# Altium schematic sheet RK3566.SchDoc
size A1; SheetNumber: 2; SheetTotal: 6
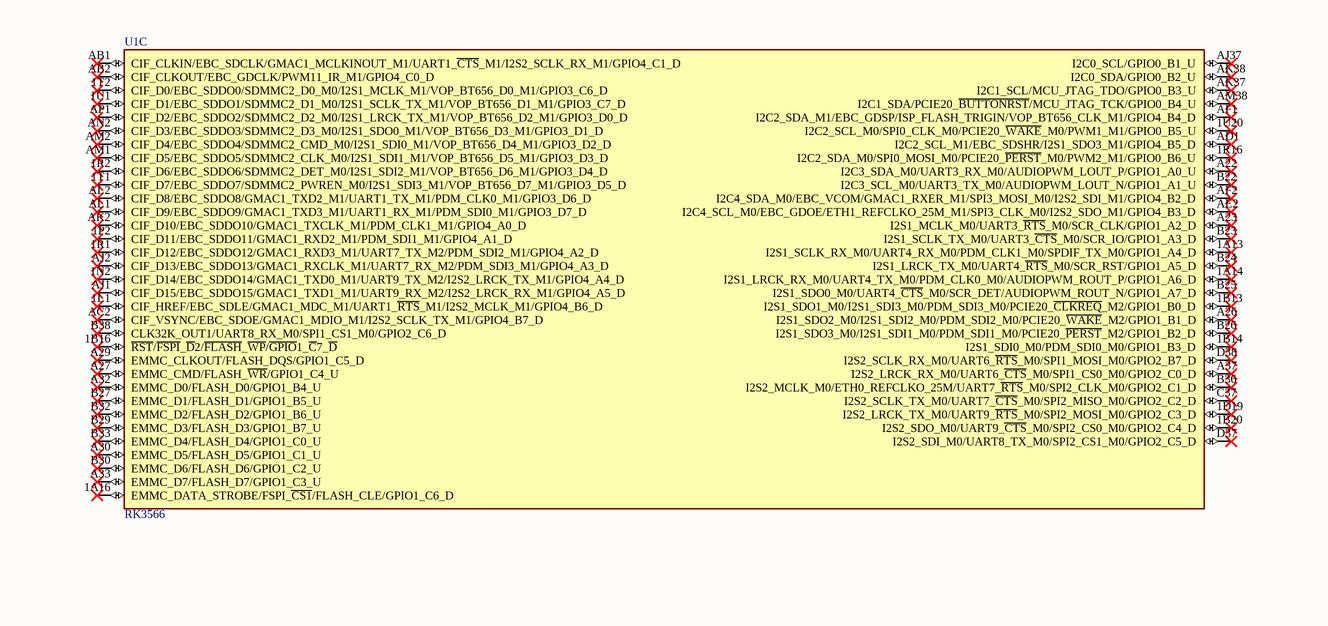
[diagram p0: RK3566.SchDoc, top left]
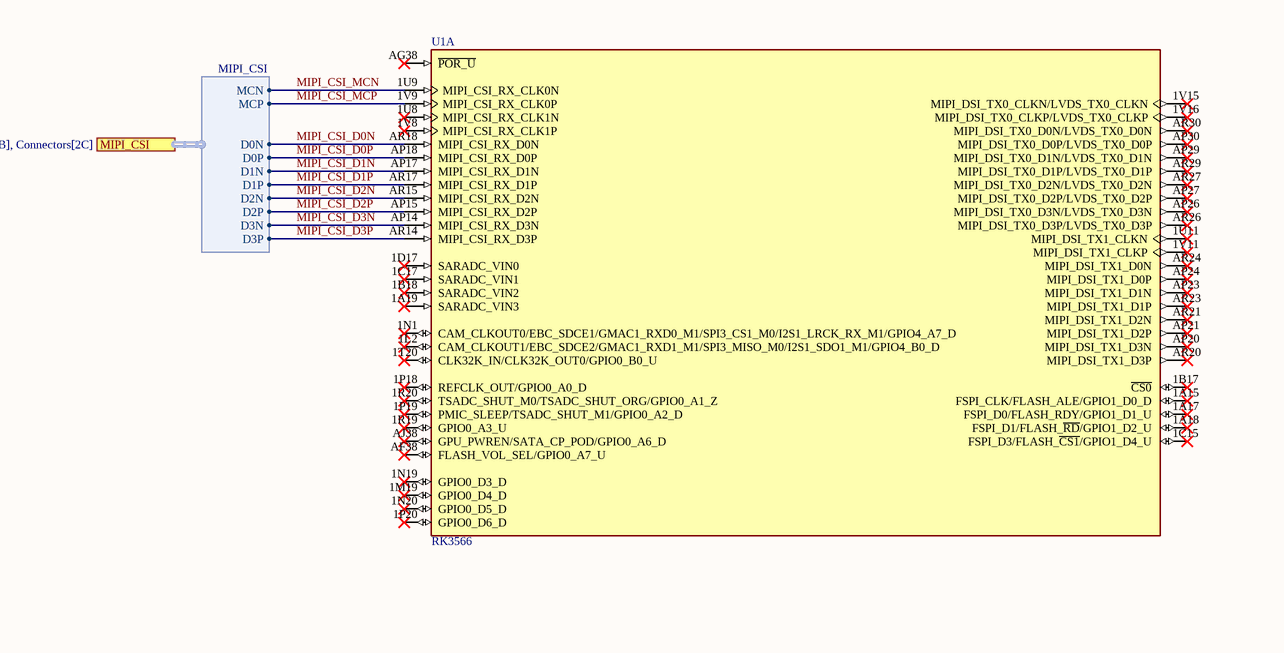
[diagram p1: RK3566.SchDoc, top right]
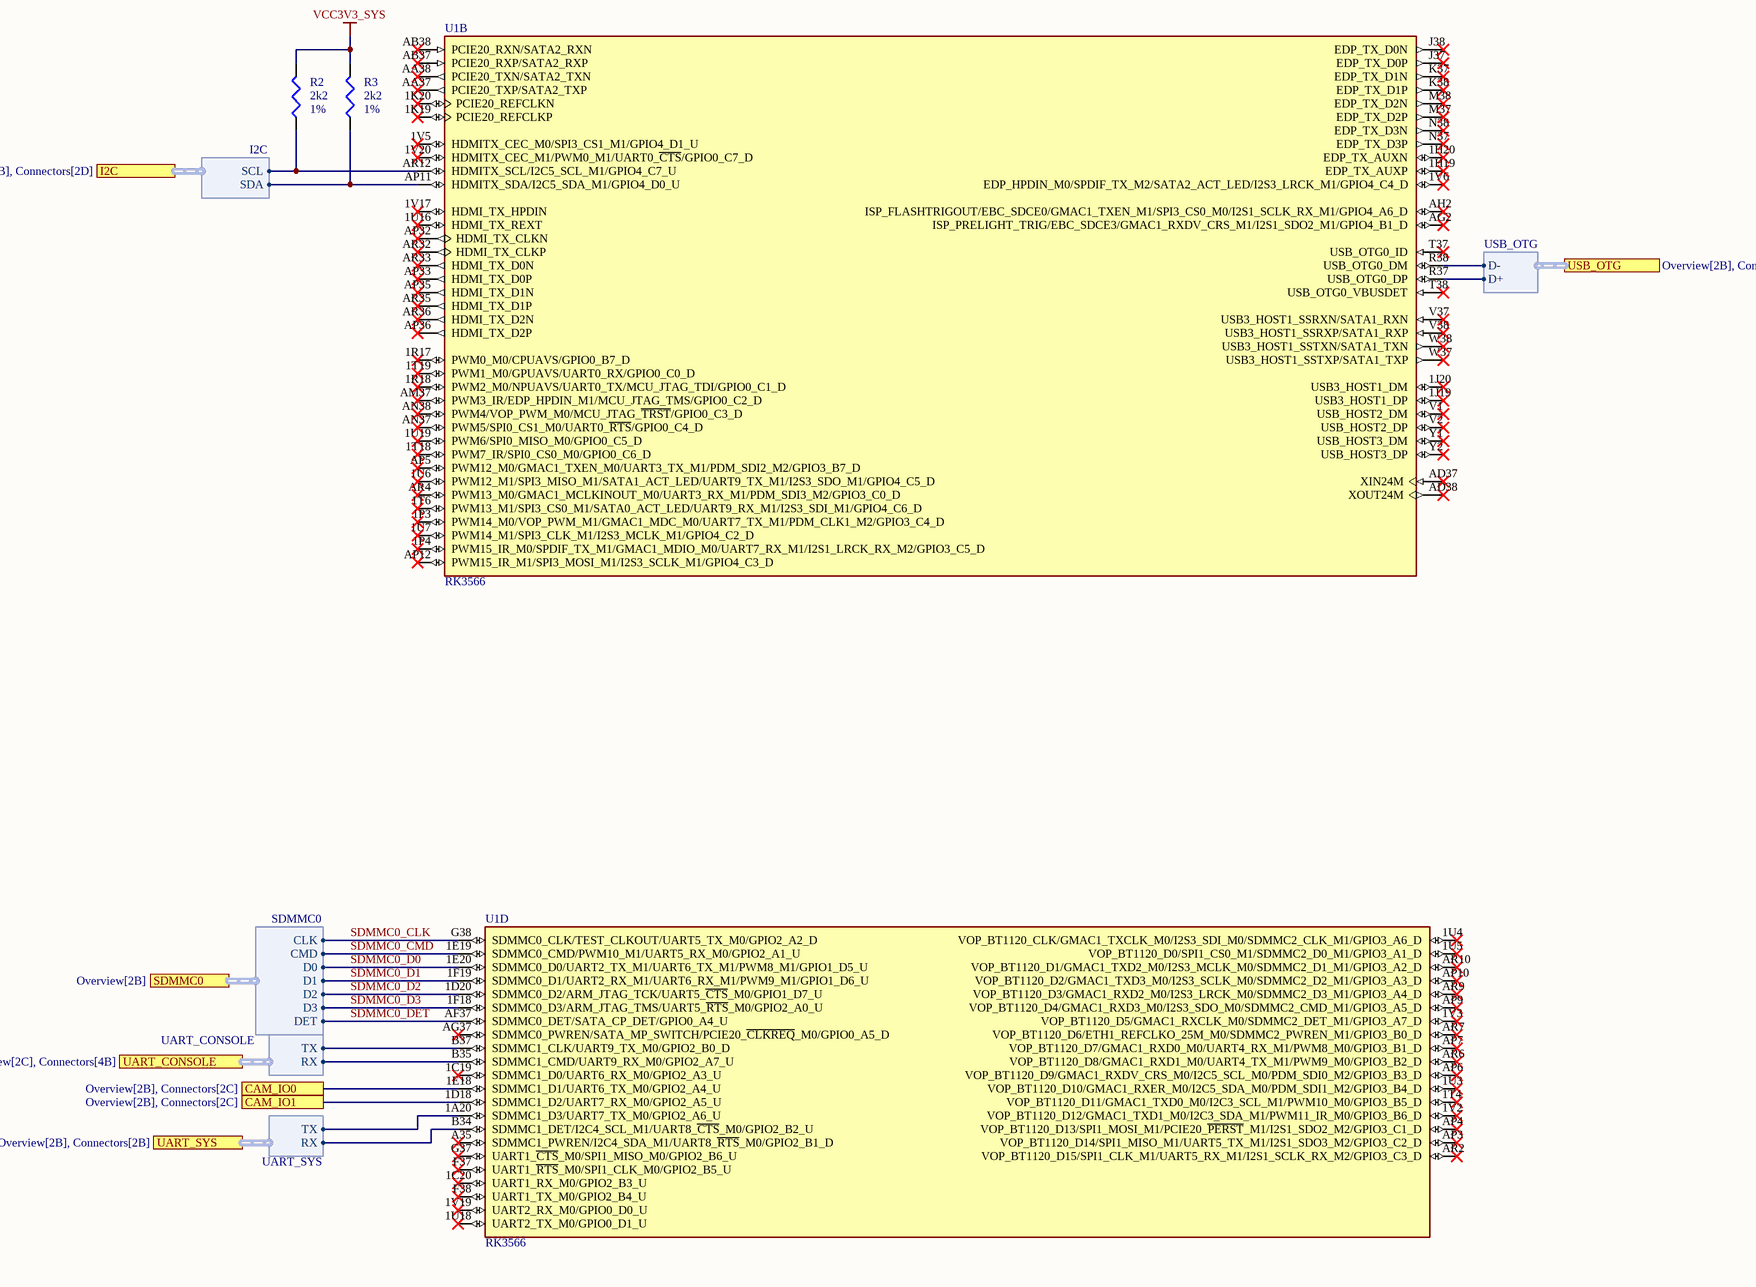
[diagram p2: RK3566.SchDoc, bottom left]
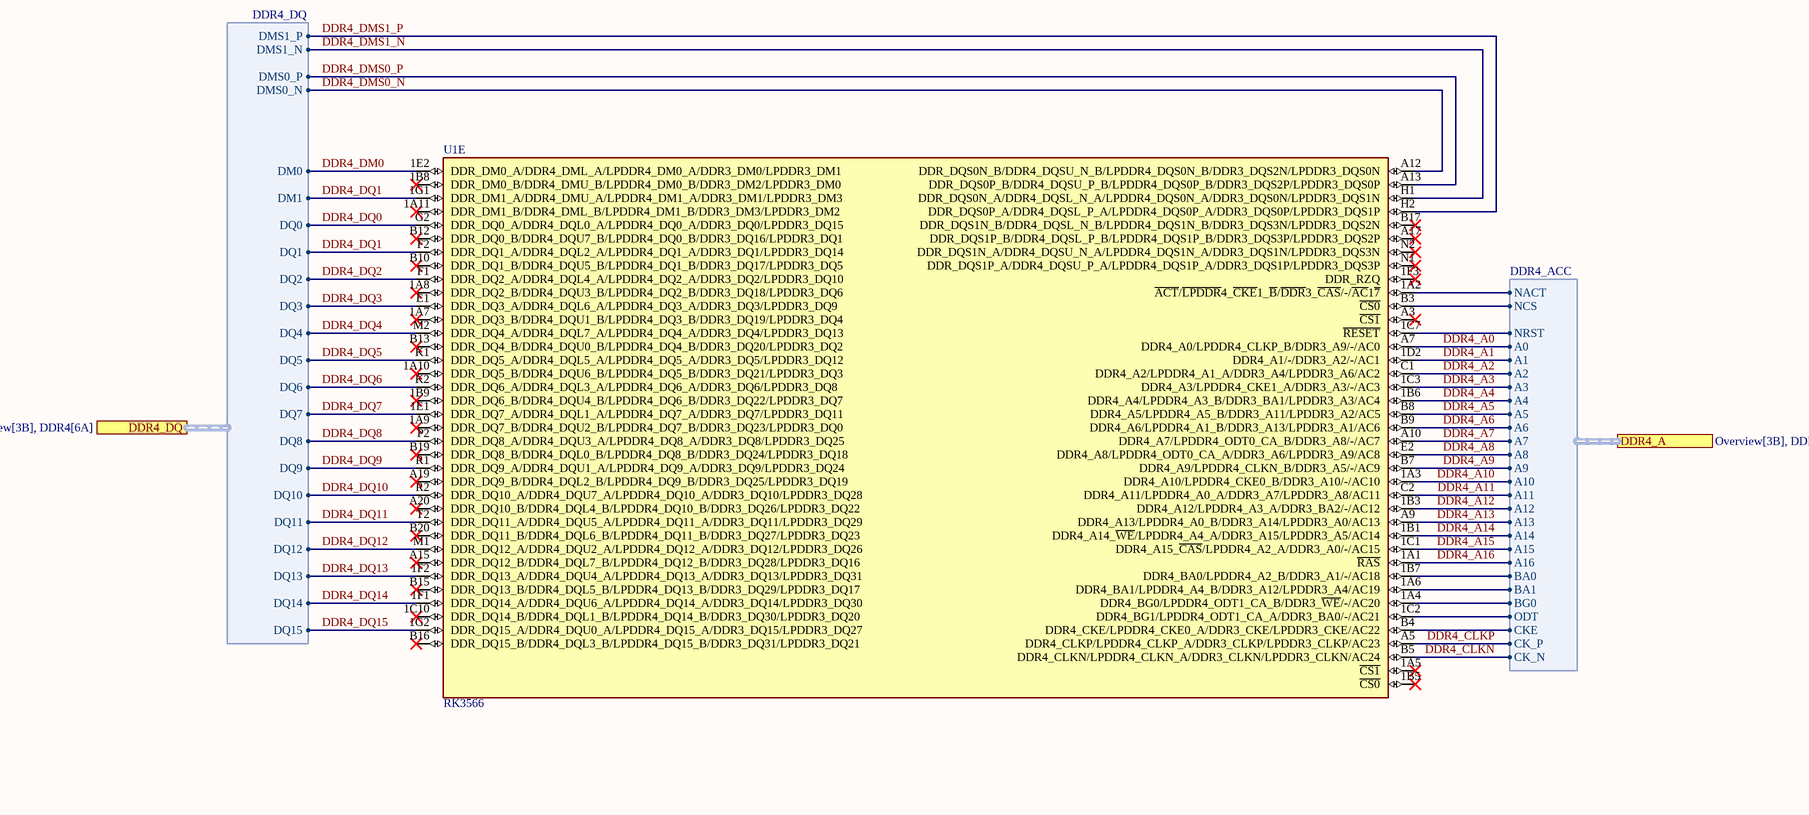
[diagram p3: RK3566.SchDoc, bottom right]

## Parts
R2  value 2k2  Tolerance: 1%  [RC0402FR-075K6L]  (hidden comment: RES 2.2K)
R3  value 2k2  Tolerance: 1%  [RC0402FR-075K6L]  (hidden comment: RES 2.2K)
U1  RK3566  [RK3566]  (parts A,B,C,D,E of 9)

## Ports
CAM_IO0 (see Overview[2B], Connectors[2C]), CAM_IO1 (see Overview[2B], Connectors[2C]), DDR4_A (harness DDR4_ACC, see Overview[3B], DDR4[2B]), DDR4_DQ (harness DDR4_DQ, see Overview[3B], DDR4[6A]), I2C (harness I2C, see Overview[2B], Connectors[2D]), MIPI_CSI (harness MIPI_CSI, see Overview[2B], Connectors[2C]), SDMMC0 (harness SDMMC0, see Overview[2B]), UART_CONSOLE (harness UART_CONSOLE, see Overview[2C], Connectors[4B]), UART_SYS (harness UART_SYS, see Overview[2B], Connectors[2B]), USB_OTG (harness USB_OTG, see Overview[2B], Connectors[6B])

## Harnesses
MIPI_CSI: D0N, D0P, MCN, MCP, D1P, D1N, D2P, D2N, D3N, D3P
SDMMC0: CLK, CMD, D0, D1, D3, D2, DET
I2C: SCL, SDA
USB_OTG: D-, D+
DDR4_ACC: A0, A1, A2, A3, A4, A5, A6, A7, A8, A10, A9, A11, A13, A12, A14, A15, A16, NCS, NACT, BG0, BA0, BA1, CKE, CK_P, CK_N, ODT, NRST
DDR4_DQ: DQ0, DQ1, DQ2, DQ3, DQ4, DQ5, DQ6, DQ7, DQ8, DQ10, DQ9, DQ11, DQ13, DQ12, DQ14, DQ15, DMS0_P, DMS0_N, DMS1_N, DMS1_P, DM0, DM1
UART_SYS: TX, RX
UART_CONSOLE: TX, RX

## Nets
VCC3V3_SYS: R2.1 R3.1
CAM_IO0: U1.1E18(SDMMC1_D1/UART6_TX_M0/GPIO2_A4_U) ; port CAM_IO0
CAM_IO1: U1.1D18(SDMMC1_D2/UART7_RX_M0/GPIO2_A5_U) ; port CAM_IO1
DDR4_A0: U1.A7(DDR4_A0/LPDDR4_CLKP_B/DDR3_A9/-/AC0) ; port DDR4_A.A0
DDR4_A1: U1.1D2(DDR4_A1/-/DDR3_A2/-/AC1) ; port DDR4_A.A1
DDR4_A2: U1.C1(DDR4_A2/LPDDR4_A1_A/DDR3_A4/LPDDR3_A6/AC2) ; port DDR4_A.A2
DDR4_A3: U1.1C3(DDR4_A3/LPDDR4_CKE1_A/DDR3_A3/-/AC3) ; port DDR4_A.A3
DDR4_A4: U1.1B6(DDR4_A4/LPDDR4_A3_B/DDR3_BA1/LPDDR3_A3/AC4) ; port DDR4_A.A4
DDR4_A5: U1.B8(DDR4_A5/LPDDR4_A5_B/DDR3_A11/LPDDR3_A2/AC5) ; port DDR4_A.A5
DDR4_A6: U1.B9(DDR4_A6/LPDDR4_A1_B/DDR3_A13/LPDDR3_A1/AC6) ; port DDR4_A.A6
DDR4_A7: U1.A10(DDR4_A7/LPDDR4_ODT0_CA_B/DDR3_A8/-/AC7) ; port DDR4_A.A7
DDR4_A8: U1.E2(DDR4_A8/LPDDR4_ODT0_CA_A/DDR3_A6/LPDDR3_A9/AC8) ; port DDR4_A.A8
DDR4_A9: U1.B7(DDR4_A9/LPDDR4_CLKN_B/DDR3_A5/-/AC9) ; port DDR4_A.A9
DDR4_A10: U1.1A3(DDR4_A10/LPDDR4_CKE0_B/DDR3_A10/-/AC10) ; port DDR4_A.A10
DDR4_A11: U1.C2(DDR4_A11/LPDDR4_A0_A/DDR3_A7/LPDDR3_A8/AC11) ; port DDR4_A.A11
DDR4_A12: U1.1B3(DDR4_A12/LPDDR4_A3_A/DDR3_BA2/-/AC12) ; port DDR4_A.A12
DDR4_A13: U1.A9(DDR4_A13/LPDDR4_A0_B/DDR3_A14/LPDDR3_A0/AC13) ; port DDR4_A.A13
DDR4_A14: U1.1B1(DDR4_A14_~{WE}/LPDDR4_A4_A/DDR3_A15/LPDDR3_A5/AC14) ; port DDR4_A.A14
DDR4_A15: U1.1C1(DDR4_A15_~{CAS}/LPDDR4_A2_A/DDR3_A0/-/AC15) ; port DDR4_A.A15
DDR4_A16: U1.1A1(~{RAS}) ; port DDR4_A.A16
DDR4_CLKN: U1.B5(DDR4_CLKN/LPDDR4_CLKN_A/DDR3_CLKN/LPDDR3_CLKN/AC24) ; port DDR4_A.CK_N
DDR4_CLKP: U1.A5(DDR4_CLKP/LPDDR4_CLKP_A/DDR3_CLKP/LPDDR3_CLKP/AC23) ; port DDR4_A.CK_P
DDR4_DM0: U1.1E2(DDR_DM0_A/DDR4_DML_A/LPDDR4_DM0_A/DDR3_DM0/LPDDR3_DM1) ; port DDR4_DQ.DM0
DDR4_DMS0_N: U1.A12(DDR_DQS0N_B/DDR4_DQSU_N_B/LPDDR4_DQS0N_B/DDR3_DQS2N/LPDDR3_DQS0N) ; port DDR4_DQ.DMS0_N
DDR4_DMS0_P: U1.A13(DDR_DQS0P_B/DDR4_DQSU_P_B/LPDDR4_DQS0P_B/DDR3_DQS2P/LPDDR3_DQS0P) ; port DDR4_DQ.DMS0_P
DDR4_DMS1_N: U1.H1(DDR_DQS0N_A/DDR4_DQSL_N_A/LPDDR4_DQS0N_A/DDR3_DQS0N/LPDDR3_DQS1N) ; port DDR4_DQ.DMS1_N
DDR4_DMS1_P: U1.H2(DDR_DQS0P_A/DDR4_DQSL_P_A/LPDDR4_DQS0P_A/DDR3_DQS0P/LPDDR3_DQS1P) ; port DDR4_DQ.DMS1_P
DDR4_DQ0: U1.G2(DDR_DQ0_A/DDR4_DQL0_A/LPDDR4_DQ0_A/DDR3_DQ0/LPDDR3_DQ15) ; port DDR4_DQ.DQ0
DDR4_DQ1: U1.1G1(DDR_DM1_A/DDR4_DMU_A/LPDDR4_DM1_A/DDR3_DM1/LPDDR3_DM3) U1.F2(DDR_DQ1_A/DDR4_DQL2_A/LPDDR4_DQ1_A/DDR3_DQ1/LPDDR3_DQ14) ; port DDR4_DQ.DQ1, port DDR4_DQ.DM1
DDR4_DQ2: U1.F1(DDR_DQ2_A/DDR4_DQL4_A/LPDDR4_DQ2_A/DDR3_DQ2/LPDDR3_DQ10) ; port DDR4_DQ.DQ2
DDR4_DQ3: U1.E1(DDR_DQ3_A/DDR4_DQL6_A/LPDDR4_DQ3_A/DDR3_DQ3/LPDDR3_DQ9) ; port DDR4_DQ.DQ3
DDR4_DQ4: U1.M2(DDR_DQ4_A/DDR4_DQL7_A/LPDDR4_DQ4_A/DDR3_DQ4/LPDDR3_DQ13) ; port DDR4_DQ.DQ4
DDR4_DQ5: U1.K1(DDR_DQ5_A/DDR4_DQL5_A/LPDDR4_DQ5_A/DDR3_DQ5/LPDDR3_DQ12) ; port DDR4_DQ.DQ5
DDR4_DQ6: U1.K2(DDR_DQ6_A/DDR4_DQL3_A/LPDDR4_DQ6_A/DDR3_DQ6/LPDDR3_DQ8) ; port DDR4_DQ.DQ6
DDR4_DQ7: U1.1E1(DDR_DQ7_A/DDR4_DQL1_A/LPDDR4_DQ7_A/DDR3_DQ7/LPDDR3_DQ11) ; port DDR4_DQ.DQ7
DDR4_DQ8: U1.P2(DDR_DQ8_A/DDR4_DQU3_A/LPDDR4_DQ8_A/DDR3_DQ8/LPDDR3_DQ25) ; port DDR4_DQ.DQ8
DDR4_DQ9: U1.R1(DDR_DQ9_A/DDR4_DQU1_A/LPDDR4_DQ9_A/DDR3_DQ9/LPDDR3_DQ24) ; port DDR4_DQ.DQ9
DDR4_DQ10: U1.R2(DDR_DQ10_A/DDR4_DQU7_A/LPDDR4_DQ10_A/DDR3_DQ10/LPDDR3_DQ28) ; port DDR4_DQ.DQ10
DDR4_DQ11: U1.T2(DDR_DQ11_A/DDR4_DQU5_A/LPDDR4_DQ11_A/DDR3_DQ11/LPDDR3_DQ29) ; port DDR4_DQ.DQ11
DDR4_DQ12: U1.M1(DDR_DQ12_A/DDR4_DQU2_A/LPDDR4_DQ12_A/DDR3_DQ12/LPDDR3_DQ26) ; port DDR4_DQ.DQ12
DDR4_DQ13: U1.1F2(DDR_DQ13_A/DDR4_DQU4_A/LPDDR4_DQ13_A/DDR3_DQ13/LPDDR3_DQ31) ; port DDR4_DQ.DQ13
DDR4_DQ14: U1.1F1(DDR_DQ14_A/DDR4_DQU6_A/LPDDR4_DQ14_A/DDR3_DQ14/LPDDR3_DQ30) ; port DDR4_DQ.DQ14
DDR4_DQ15: U1.1G2(DDR_DQ15_A/DDR4_DQU0_A/LPDDR4_DQ15_A/DDR3_DQ15/LPDDR3_DQ27) ; port DDR4_DQ.DQ15
MIPI_CSI_D0N: U1.AR18(MIPI_CSI_RX_D0N) ; port MIPI_CSI.D0N
MIPI_CSI_D0P: U1.AP18(MIPI_CSI_RX_D0P) ; port MIPI_CSI.D0P
MIPI_CSI_D1N: U1.AP17(MIPI_CSI_RX_D1N) ; port MIPI_CSI.D1N
MIPI_CSI_D1P: U1.AR17(MIPI_CSI_RX_D1P) ; port MIPI_CSI.D1P
MIPI_CSI_D2N: U1.AR15(MIPI_CSI_RX_D2N) ; port MIPI_CSI.D2N
MIPI_CSI_D2P: U1.AP15(MIPI_CSI_RX_D2P) ; port MIPI_CSI.D2P
MIPI_CSI_D3N: U1.AP14(MIPI_CSI_RX_D3N) ; port MIPI_CSI.D3N
MIPI_CSI_D3P: U1.AR14(MIPI_CSI_RX_D3P) ; port MIPI_CSI.D3P
MIPI_CSI_MCN: U1.1U9(MIPI_CSI_RX_CLK0N) ; port MIPI_CSI.MCN
MIPI_CSI_MCP: U1.1V9(MIPI_CSI_RX_CLK0P) ; port MIPI_CSI.MCP
SDMMC0_CLK: U1.G38(SDMMC0_CLK/TEST_CLKOUT/UART5_TX_M0/GPIO2_A2_D) ; port SDMMC0.CLK
SDMMC0_CMD: U1.1E19(SDMMC0_CMD/PWM10_M1/UART5_RX_M0/GPIO2_A1_U) ; port SDMMC0.CMD
SDMMC0_D0: U1.1E20(SDMMC0_D0/UART2_TX_M1/UART6_TX_M1/PWM8_M1/GPIO1_D5_U) ; port SDMMC0.D0
SDMMC0_D1: U1.1F19(SDMMC0_D1/UART2_RX_M1/UART6_RX_M1/PWM9_M1/GPIO1_D6_U) ; port SDMMC0.D1
SDMMC0_D2: U1.1D20(SDMMC0_D2/ARM_JTAG_TCK/UART5_~{CTS}_M0/GPIO1_D7_U) ; port SDMMC0.D2
SDMMC0_D3: U1.1F18(SDMMC0_D3/ARM_JTAG_TMS/UART5_~{RTS}_M0/GPIO2_A0_U) ; port SDMMC0.D3
SDMMC0_DET: U1.AF37(SDMMC0_DET/SATA_CP_DET/GPIO0_A4_U) ; port SDMMC0.DET
NetR2_2: R2.2 U1.AR12(HDMITX_SCL/I2C5_SCL_M1/GPIO4_C7_U) ; port I2C.SCL
NetR3_2: R3.2 U1.AP11(HDMITX_SDA/I2C5_SDA_M1/GPIO4_D0_U) ; port I2C.SDA
NetU1_1A2: U1.1A2(~{ACT}/~{LPDDR}4_~{CKE}1_~{B}/~{DDR}3_~{CAS}/-/~{AC}1~{7}) ; port DDR4_A.NACT
NetU1_1A4: U1.1A4(DDR4_BG0/LPDDR4_ODT1_CA_B/DDR3_~{WE}/-/AC20) ; port DDR4_A.BG0
NetU1_1A6: U1.1A6(DDR4_BA1/LPDDR4_A4_B/DDR3_A12/LPDDR3_A4/AC19) ; port DDR4_A.BA1
NetU1_1A20: U1.1A20(SDMMC1_D3/UART7_TX_M0/GPIO2_A6_U) ; port UART_SYS.TX
NetU1_1B7: U1.1B7(DDR4_BA0/LPDDR4_A2_B/DDR3_A1/-/AC18) ; port DDR4_A.BA0
NetU1_1C2: U1.1C2(DDR4_BG1/LPDDR4_ODT1_CA_A/DDR3_BA0/-/AC21) ; port DDR4_A.ODT
NetU1_1C7: U1.1C7(~{RESET}) ; port DDR4_A.NRST
NetU1_B3: U1.B3(~{CS0}) ; port DDR4_A.NCS
NetU1_B4: U1.B4(DDR4_CKE/LPDDR4_CKE0_A/DDR3_CKE/LPDDR3_CKE/AC22) ; port DDR4_A.CKE
NetU1_B34: U1.B34(SDMMC1_DET/I2C4_SCL_M1/UART8_~{CTS}_M0/GPIO2_B2_U) ; port UART_SYS.RX
NetU1_B35: U1.B35(SDMMC1_CMD/UART9_RX_M0/GPIO2_A7_U) ; port UART_CONSOLE.RX
NetU1_B37: U1.B37(SDMMC1_CLK/UART9_TX_M0/GPIO2_B0_D) ; port UART_CONSOLE.TX
NetU1_R37: U1.R37(USB_OTG0_DP) ; port USB_OTG.D+
NetU1_R38: U1.R38(USB_OTG0_DM) ; port USB_OTG.D-

Not connected (* = marked no-connect by the designer): U1 1A5(~{CS1})* 1A7(DDR_DQ3_B/DDR4_DQU1_B/LPDDR4_DQ3_B/DDR3_DQ19/LPDDR3_DQ4)* 1A8(DDR_DQ2_B/DDR4_DQU3_B/LPDDR4_DQ2_B/DDR3_DQ18/LPDDR3_DQ6)* 1A9(DDR_DQ7_B/DDR4_DQU2_B/LPDDR4_DQ7_B/DDR3_DQ23/LPDDR3_DQ0)* 1A10(DDR_DQ5_B/DDR4_DQU6_B/LPDDR4_DQ5_B/DDR3_DQ21/LPDDR3_DQ3)* 1A11(DDR_DM1_B/DDR4_DML_B/LPDDR4_DM1_B/DDR3_DM3/LPDDR3_DM2)* 1A13(I2S1_SCLK_RX_M0/UART4_RX_M0/PDM_CLK1_M0/SPDIF_TX_M0/GPIO1_A4_D)* 1A14(I2S1_LRCK_RX_M0/UART4_TX_M0/PDM_CLK0_M0/AUDIOPWM_ROUT_P/GPIO1_A6_D)* 1A15(FSPI_CLK/FLASH_ALE/GPIO1_D0_D)* 1A16(EMMC_DATA_STROBE/FSPI_~{CS1}/FLASH_CLE/GPIO1_C6_D)* 1A17(FSPI_D0/FLASH_RDY/GPIO1_D1_U)* 1A18(FSPI_D1/FLASH_~{RD}/GPIO1_D2_U)* 1A19(SARADC_VIN3)* 1B5(~{CS0})* 1B8(DDR_DM0_B/DDR4_DMU_B/LPDDR4_DM0_B/DDR3_DM2/LPDDR3_DM0)* 1B9(DDR_DQ6_B/DDR4_DQU4_B/LPDDR4_DQ6_B/DDR3_DQ22/LPDDR3_DQ7)* 1B13(I2S1_SDO1_M0/I2S1_SDI3_M0/PDM_SDI3_M0/PCIE20_~{CLKREQ}_M2/GPIO1_B0_D)* 1B14(I2S1_SDI0_M0/PDM_SDI0_M0/GPIO1_B3_D)* 1B16(~{RST}/~{FSPI}_~{D}2/~{FLASH}_~{WP}/~{GPIO}1_~{C}7_~{D})* 1B17(~{CS0})* 1B18(SARADC_VIN2)* 1B20(I2S2_SDO_M0/UART9_~{CTS}_M0/SPI2_CS0_M0/GPIO2_C4_D)* 1C10(DDR_DQ14_B/DDR4_DQL1_B/LPDDR4_DQ14_B/DDR3_DQ30/LPDDR3_DQ20)* 1C15(FSPI_D3/FLASH_~{CS1}/GPIO1_D4_U)* 1C17(SARADC_VIN1)* 1C19(SDMMC1_D0/UART6_RX_M0/GPIO2_A3_U)* 1C20(UART1_RX_M0/GPIO2_B3_U)* 1D17(SARADC_VIN0)* 1D19(I2S2_LRCK_TX_M0/UART9_~{RTS}_M0/SPI2_MOSI_M0/GPIO2_C3_D)* 1F3(DDR_RZQ)* 1H19(EDP_TX_AUXP)* 1H20(EDP_TX_AUXN)* 1J19(USB3_HOST1_DP)* 1J20(USB3_HOST1_DM)* 1K19(PCIE20_REFCLKP)* 1K20(PCIE20_REFCLKN)* 1L1(CIF_HREF/EBC_SDLE/GMAC1_MDC_M1/UART1_~{RTS}_M1/I2S2_MCLK_M1/GPIO4_B6_D)* 1L2(CAM_CLKOUT1/EBC_SDCE2/GMAC1_RXD1_M1/SPI3_MISO_M0/I2S1_SDO1_M1/GPIO4_B0_D)* 1M19(GPIO0_D4_D)* 1N1(CAM_CLKOUT0/EBC_SDCE1/GMAC1_RXD0_M1/SPI3_CS1_M0/I2S1_LRCK_RX_M1/GPIO4_A7_D)* 1N2(CIF_D14/EBC_SDDO14/GMAC1_TXD0_M1/UART9_TX_M2/I2S2_LRCK_TX_M1/GPIO4_A4_D)* 1N19(GPIO0_D3_D)* 1N20(GPIO0_D5_D)* 1P2(CIF_D11/EBC_SDDO11/GMAC1_RXD2_M1/PDM_SDI1_M1/GPIO4_A1_D)* 1P3(PWM14_M0/VOP_PWM_M1/GMAC1_MDC_M0/UART7_TX_M1/PDM_CLK1_M2/GPIO3_C4_D)* 1P4(PWM15_IR_M0/SPDIF_TX_M1/GMAC1_MDIO_M0/UART7_RX_M1/I2S1_LRCK_RX_M2/GPIO3_C5_D)* 1P18(REFCLK_OUT/GPIO0_A0_D)* 1P19(PMIC_SLEEP/TSADC_SHUT_M1/GPIO0_A2_D)* 1P20(GPIO0_D6_D)* 1R1(CIF_D12/EBC_SDDO12/GMAC1_RXD3_M1/UART7_TX_M2/PDM_SDI2_M1/GPIO4_A2_D)* 1R2(CIF_D6/EBC_SDDO6/SDMMC2_DET_M0/I2S1_SDI2_M1/VOP_BT656_D6_M1/GPIO3_D4_D)* 1R16(I2C2_SDA_M0/SPI0_MOSI_M0/PCIE20_~{PERST}_M0/PWM2_M1/GPIO0_B6_U)* 1R17(PWM0_M0/CPUAVS/GPIO0_B7_D)* 1R18(PWM2_M0/NPUAVS/UART0_TX/MCU_JTAG_TDI/GPIO0_C1_D)* 1R19(GPIO0_A3_U)* 1R20(TSADC_SHUT_M0/TSADC_SHUT_ORG/GPIO0_A1_Z)* 1T1(CIF_D7/EBC_SDDO7/SDMMC2_PWREN_M0/I2S1_SDI3_M1/VOP_BT656_D7_M1/GPIO3_D5_D)* 1T2(CIF_D0/EBC_SDDO0/SDMMC2_D0_M0/I2S1_MCLK_M1/VOP_BT656_D0_M1/GPIO3_C6_D)* 1T4(VOP_BT1120_D11/GMAC1_TXD0_M0/I2C3_SCL_M1/PWM10_M0/GPIO3_B5_D)* 1T6(PWM13_M1/SPI3_CS0_M1/SATA0_ACT_LED/UART9_RX_M1/I2S3_SDI_M1/GPIO4_C6_D)* 1T18(PWM7_IR/SPI0_CS0_M0/GPIO0_C6_D)* 1T19(PWM1_M0/GPUAVS/UART0_RX/GPIO0_C0_D)* 1T20(CLK32K_IN/CLK32K_OUT0/GPIO0_B0_U)* 1U1(CIF_D1/EBC_SDDO1/SDMMC2_D1_M0/I2S1_SCLK_TX_M1/VOP_BT656_D1_M1/GPIO3_C7_D)* 1U3(VOP_BT1120_D10/GMAC1_RXER_M0/I2C5_SDA_M0/PDM_SDI1_M2/GPIO3_B4_D)* 1U4(VOP_BT1120_CLK/GMAC1_TXCLK_M0/I2S3_SDI_M0/SDMMC2_CLK_M1/GPIO3_A6_D)* 1U5(VOP_BT1120_D0/SPI1_CS0_M1/SDMMC2_D0_M1/GPIO3_A1_D)* 1U6(PWM12_M1/SPI3_MISO_M1/SATA1_ACT_LED/UART9_TX_M1/I2S3_SDO_M1/GPIO4_C5_D)* 1U7(PWM14_M1/SPI3_CLK_M1/I2S3_MCLK_M1/GPIO4_C2_D)* 1U8(MIPI_CSI_RX_CLK1N)* 1U11(MIPI_DSI_TX1_CLKN)* 1U16(HDMI_TX_REXT)* 1U18(UART2_TX_M0/GPIO0_D1_U)* 1U19(PWM6/SPI0_MISO_M0/GPIO0_C5_D)* 1U20(I2C2_SCL_M0/SPI0_CLK_M0/PCIE20_~{WAKE}_M0/PWM1_M1/GPIO0_B5_U)* 1V2(VOP_BT1120_D12/GMAC1_TXD1_M0/I2C3_SDA_M1/PWM11_IR_M0/GPIO3_B6_D)* 1V3(VOP_BT1120_D5/GMAC1_RXCLK_M0/SDMMC2_DET_M1/GPIO3_A7_D)* 1V5(HDMITX_CEC_M0/SPI3_CS1_M1/GPIO4_D1_U)* 1V6(EDP_HPDIN_M0/SPDIF_TX_M2/SATA2_ACT_LED/I2S3_LRCK_M1/GPIO4_C4_D)* 1V8(MIPI_CSI_RX_CLK1P)* 1V11(MIPI_DSI_TX1_CLKP)* 1V15(MIPI_DSI_TX0_CLKN/LVDS_TX0_CLKN)* 1V16(MIPI_DSI_TX0_CLKP/LVDS_TX0_CLKP)* 1V17(HDMI_TX_HPDIN)* 1V19(UART2_RX_M0/GPIO0_D0_U)* 1V20(HDMITX_CEC_M1/PWM0_M1/UART0_~{CTS}/GPIO0_C7_D)* A3(~{CS1})* A15(DDR_DQ12_B/DDR4_DQL7_B/LPDDR4_DQ12_B/DDR3_DQ28/LPDDR3_DQ16)* A17(DDR_DQS1P_B/DDR4_DQSL_P_B/LPDDR4_DQS1P_B/DDR3_DQS3P/LPDDR3_DQS2P)* A19(DDR_DQ9_B/DDR4_DQL2_B/LPDDR4_DQ9_B/DDR3_DQ25/LPDDR3_DQ19)* A20(DDR_DQ10_B/DDR4_DQL4_B/LPDDR4_DQ10_B/DDR3_DQ26/LPDDR3_DQ22)* A22(I2C3_SDA_M0/UART3_RX_M0/AUDIOPWM_LOUT_P/GPIO1_A0_U)* A23(I2S1_MCLK_M0/UART3_~{RTS}_M0/SCR_CLK/GPIO1_A2_D)* A26(I2S1_SDO2_M0/I2S1_SDI2_M0/PDM_SDI2_M0/PCIE20_~{WAKE}_M2/GPIO1_B1_D)* A27(EMMC_CMD/FLASH_~{WR}/GPIO1_C4_U)* A29(EMMC_CLKOUT/FLASH_DQS/GPIO1_C5_D)* A30(EMMC_D5/FLASH_D5/GPIO1_C1_U)* A32(EMMC_D0/FLASH_D0/GPIO1_B4_U)* A33(EMMC_D7/FLASH_D7/GPIO1_C3_U)* A35(SDMMC1_PWREN/I2C4_SDA_M1/UART8_~{RTS}_M0/GPIO2_B1_D)* A37(I2S2_LRCK_RX_M0/UART6_~{CTS}_M0/SPI1_CS0_M0/GPIO2_C0_D)* AA37(PCIE20_TXP/SATA2_TXP)* AA38(PCIE20_TXN/SATA2_TXN)* AB1(CIF_CLKIN/EBC_SDCLK/GMAC1_MCLKINOUT_M1/UART1_~{CTS}_M1/I2S2_SCLK_RX_M1/GPIO4_C1_D)* AB2(CIF_CLKOUT/EBC_GDCLK/PWM11_IR_M1/GPIO4_C0_D)* AB37(PCIE20_RXP/SATA2_RXP)* AB38(PCIE20_RXN/SATA2_RXN)* AC2(CIF_VSYNC/EBC_SDOE/GMAC1_MDIO_M1/I2S2_SCLK_TX_M1/GPIO4_B7_D)* AD1(I2C2_SCL_M1/EBC_SDSHR/I2S1_SDO3_M1/GPIO4_B5_D)* AD37(XIN24M)* AD38(XOUT24M)* AE2(I2C4_SCL_M0/EBC_GDOE/ETH1_REFCLKO_25M_M1/SPI3_CLK_M0/I2S2_SDO_M1/GPIO4_B3_D)* AF1(I2C2_SDA_M1/EBC_GDSP/ISP_FLASH_TRIGIN/VOP_BT656_CLK_M1/GPIO4_B4_D)* AF2(I2C4_SDA_M0/EBC_VCOM/GMAC1_RXER_M1/SPI3_MOSI_M0/I2S2_SDI_M1/GPIO4_B2_D)* AF38(FLASH_VOL_SEL/GPIO0_A7_U)* AG2(ISP_PRELIGHT_TRIG/EBC_SDCE3/GMAC1_RXDV_CRS_M1/I2S1_SDO2_M1/GPIO4_B1_D)* AG37(SDMMC0_PWREN/SATA_MP_SWITCH/PCIE20_~{CLKREQ}_M0/GPIO0_A5_D)* AG38(~{POR_U})* AH2(ISP_FLASHTRIGOUT/EBC_SDCE0/GMAC1_TXEN_M1/SPI3_CS0_M0/I2S1_SCLK_RX_M1/GPIO4_A6_D)* AJ1(CIF_D15/EBC_SDDO15/GMAC1_TXD1_M1/UART9_RX_M2/I2S2_LRCK_RX_M1/GPIO4_A5_D)* AJ2(CIF_D13/EBC_SDDO13/GMAC1_RXCLK_M1/UART7_RX_M2/PDM_SDI3_M1/GPIO4_A3_D)* AJ37(I2C0_SCL/GPIO0_B1_U)* AJ38(GPU_PWREN/SATA_CP_POD/GPIO0_A6_D)* AK2(CIF_D10/EBC_SDDO10/GMAC1_TXCLK_M1/PDM_CLK1_M1/GPIO4_A0_D)* AK37(I2C1_SCL/MCU_JTAG_TDO/GPIO0_B3_U)* AK38(I2C0_SDA/GPIO0_B2_U)* AL1(CIF_D9/EBC_SDDO9/GMAC1_TXD3_M1/UART1_RX_M1/PDM_SDI0_M1/GPIO3_D7_D)* AL2(CIF_D8/EBC_SDDO8/GMAC1_TXD2_M1/UART1_TX_M1/PDM_CLK0_M1/GPIO3_D6_D)* AM1(CIF_D5/EBC_SDDO5/SDMMC2_CLK_M0/I2S1_SDI1_M1/VOP_BT656_D5_M1/GPIO3_D3_D)* AM2(CIF_D4/EBC_SDDO4/SDMMC2_CMD_M0/I2S1_SDI0_M1/VOP_BT656_D4_M1/GPIO3_D2_D)* AM37(PWM3_IR/EDP_HPDIN_M1/MCU_JTAG_TMS/GPIO0_C2_D)* AM38(I2C1_SDA/PCIE20_~{BUTTONRST}/MCU_JTAG_TCK/GPIO0_B4_U)* AN2(CIF_D3/EBC_SDDO3/SDMMC2_D3_M0/I2S1_SDO0_M1/VOP_BT656_D3_M1/GPIO3_D1_D)* AN37(PWM5/SPI0_CS1_M0/UART0_~{RTS}/GPIO0_C4_D)* AN38(PWM4/VOP_PWM_M0/MCU_JTAG_~{TRST}/GPIO0_C3_D)* AP1(CIF_D2/EBC_SDDO2/SDMMC2_D2_M0/I2S1_LRCK_TX_M1/VOP_BT656_D2_M1/GPIO3_D0_D)* AP3(VOP_BT1120_D14/SPI1_MISO_M1/UART5_TX_M1/I2S1_SDO3_M2/GPIO3_C2_D)* AP4(VOP_BT1120_D13/SPI1_MOSI_M1/PCIE20_~{PERST}_M1/I2S1_SDO2_M2/GPIO3_C1_D)* AP5(PWM12_M0/GMAC1_TXEN_M0/UART3_TX_M1/PDM_SDI2_M2/GPIO3_B7_D)* AP6(VOP_BT1120_D9/GMAC1_RXDV_CRS_M0/I2C5_SCL_M0/PDM_SDI0_M2/GPIO3_B3_D)* AP7(VOP_BT1120_D7/GMAC1_RXD0_M0/UART4_RX_M1/PWM8_M0/GPIO3_B1_D)* AP9(VOP_BT1120_D4/GMAC1_RXD3_M0/I2S3_SDO_M0/SDMMC2_CMD_M1/GPIO3_A5_D)* AP10(VOP_BT1120_D2/GMAC1_TXD3_M0/I2S3_SCLK_M0/SDMMC2_D2_M1/GPIO3_A3_D)* AP12(PWM15_IR_M1/SPI3_MOSI_M1/I2S3_SCLK_M1/GPIO4_C3_D)* AP20(MIPI_DSI_TX1_D3N)* AP21(MIPI_DSI_TX1_D2P)* AP23(MIPI_DSI_TX1_D1N)* AP24(MIPI_DSI_TX1_D0P)* AP26(MIPI_DSI_TX0_D3N/LVDS_TX0_D3N)* AP27(MIPI_DSI_TX0_D2P/LVDS_TX0_D2P)* AP29(MIPI_DSI_TX0_D1N/LVDS_TX0_D1N)* AP30(MIPI_DSI_TX0_D0P/LVDS_TX0_D0P)* AP32(HDMI_TX_CLKN)* AP33(HDMI_TX_D0P)* AP35(HDMI_TX_D1N)* AP36(HDMI_TX_D2P)* AR2(VOP_BT1120_D15/SPI1_CLK_M1/UART5_RX_M1/I2S1_SCLK_RX_M2/GPIO3_C3_D)* AR4(PWM13_M0/GMAC1_MCLKINOUT_M0/UART3_RX_M1/PDM_SDI3_M2/GPIO3_C0_D)* AR6(VOP_BT1120_D8/GMAC1_RXD1_M0/UART4_TX_M1/PWM9_M0/GPIO3_B2_D)* AR7(VOP_BT1120_D6/ETH1_REFCLKO_25M_M0/SDMMC2_PWREN_M1/GPIO3_B0_D)* AR9(VOP_BT1120_D3/GMAC1_RXD2_M0/I2S3_LRCK_M0/SDMMC2_D3_M1/GPIO3_A4_D)* AR10(VOP_BT1120_D1/GMAC1_TXD2_M0/I2S3_MCLK_M0/SDMMC2_D1_M1/GPIO3_A2_D)* AR20(MIPI_DSI_TX1_D3P)* AR21(MIPI_DSI_TX1_D2N)* AR23(MIPI_DSI_TX1_D1P)* AR24(MIPI_DSI_TX1_D0N)* AR26(MIPI_DSI_TX0_D3P/LVDS_TX0_D3P)* AR27(MIPI_DSI_TX0_D2N/LVDS_TX0_D2N)* AR29(MIPI_DSI_TX0_D1P/LVDS_TX0_D1P)* AR30(MIPI_DSI_TX0_D0N/LVDS_TX0_D0N)* AR32(HDMI_TX_CLKP)* AR33(HDMI_TX_D0N)* AR35(HDMI_TX_D1P)* AR36(HDMI_TX_D2N)* B10(DDR_DQ1_B/DDR4_DQU5_B/LPDDR4_DQ1_B/DDR3_DQ17/LPDDR3_DQ5)* B12(DDR_DQ0_B/DDR4_DQU7_B/LPDDR4_DQ0_B/DDR3_DQ16/LPDDR3_DQ1)* B13(DDR_DQ4_B/DDR4_DQU0_B/LPDDR4_DQ4_B/DDR3_DQ20/LPDDR3_DQ2)* B15(DDR_DQ13_B/DDR4_DQL5_B/LPDDR4_DQ13_B/DDR3_DQ29/LPDDR3_DQ17)* B16(DDR_DQ15_B/DDR4_DQL3_B/LPDDR4_DQ15_B/DDR3_DQ31/LPDDR3_DQ21)* B17(DDR_DQS1N_B/DDR4_DQSL_N_B/LPDDR4_DQS1N_B/DDR3_DQS3N/LPDDR3_DQS2N)* B19(DDR_DQ8_B/DDR4_DQL0_B/LPDDR4_DQ8_B/DDR3_DQ24/LPDDR3_DQ18)* B20(DDR_DQ11_B/DDR4_DQL6_B/LPDDR4_DQ11_B/DDR3_DQ27/LPDDR3_DQ23)* B22(I2C3_SCL_M0/UART3_TX_M0/AUDIOPWM_LOUT_N/GPIO1_A1_U)* B23(I2S1_SCLK_TX_M0/UART3_~{CTS}_M0/SCR_IO/GPIO1_A3_D)* B24(I2S1_LRCK_TX_M0/UART4_~{RTS}_M0/SCR_RST/GPIO1_A5_D)* B25(I2S1_SDO0_M0/UART4_~{CTS}_M0/SCR_DET/AUDIOPWM_ROUT_N/GPIO1_A7_D)* B26(I2S1_SDO3_M0/I2S1_SDI1_M0/PDM_SDI1_M0/PCIE20_~{PERST}_M2/GPIO1_B2_D)* B27(EMMC_D1/FLASH_D1/GPIO1_B5_U)* B29(EMMC_D3/FLASH_D3/GPIO1_B7_U)* B30(EMMC_D6/FLASH_D6/GPIO1_C2_U)* B32(EMMC_D2/FLASH_D2/GPIO1_B6_U)* B33(EMMC_D4/FLASH_D4/GPIO1_C0_U)* B36(I2S2_MCLK_M0/ETH0_REFCLKO_25M/UART7_~{RTS}_M0/SPI2_CLK_M0/GPIO2_C1_D)* B38(CLK32K_OUT1/UART8_RX_M0/SPI1_CS1_M0/GPIO2_C6_D)* C37(I2S2_SCLK_TX_M0/UART7_~{CTS}_M0/SPI2_MISO_M0/GPIO2_C2_D)* D37(I2S2_SDI_M0/UART8_TX_M0/SPI2_CS1_M0/GPIO2_C5_D)* D38(I2S2_SCLK_RX_M0/UART6_~{RTS}_M0/SPI1_MOSI_M0/GPIO2_B7_D)* F37(UART1_~{RTS}_M0/SPI1_CLK_M0/GPIO2_B5_U)* F38(UART1_TX_M0/GPIO2_B4_U)* G37(UART1_~{CTS}_M0/SPI1_MISO_M0/GPIO2_B6_U)* J37(EDP_TX_D0P)* J38(EDP_TX_D0N)* K37(EDP_TX_D1N)* K38(EDP_TX_D1P)* M37(EDP_TX_D2P)* M38(EDP_TX_D2N)* N1(DDR_DQS1P_A/DDR4_DQSU_P_A/LPDDR4_DQS1P_A/DDR3_DQS1P/LPDDR3_DQS3P)* N2(DDR_DQS1N_A/DDR4_DQSU_N_A/LPDDR4_DQS1N_A/DDR3_DQS1N/LPDDR3_DQS3N)* N37(EDP_TX_D3P)* N38(EDP_TX_D3N)* T37(USB_OTG0_ID)* T38(USB_OTG0_VBUSDET)* V1(USB_HOST2_DM)* V2(USB_HOST2_DP)* V37(USB3_HOST1_SSRXN/SATA1_RXN)* V38(USB3_HOST1_SSRXP/SATA1_RXP)* W37(USB3_HOST1_SSTXP/SATA1_TXP)* W38(USB3_HOST1_SSTXN/SATA1_TXN)* Y1(USB_HOST3_DM)* Y2(USB_HOST3_DP)*

## Library data of the parts
R2 R3 = RES 2.2K: RES 2.2k 1% 62.5mW 0402; Size: 0402; Manufacturer Part Number 1: RC0402FR-075K6L
U1 = RK3566: high-performance and low-power quad-core application processor; MF: Fuzhou Rockchip Electronics Co; SnapEDA_Link: https://www.snapeda.com/parts/RK3566/Fuzhou+Rockchip+Electronics+Co/view-part/?ref=snap; Package: None; Value: *; MP: RK3566; Check_prices: https://www.snapeda.com/parts/RK3566/Fuzhou+Rockchip+Electronics+Co/view-part/?ref=eda